# Altium schematic sheet Analog_Frontend01.SchDoc
size A4; DocumentNumber: 2; SheetNumber: 1; SheetTotal: 5
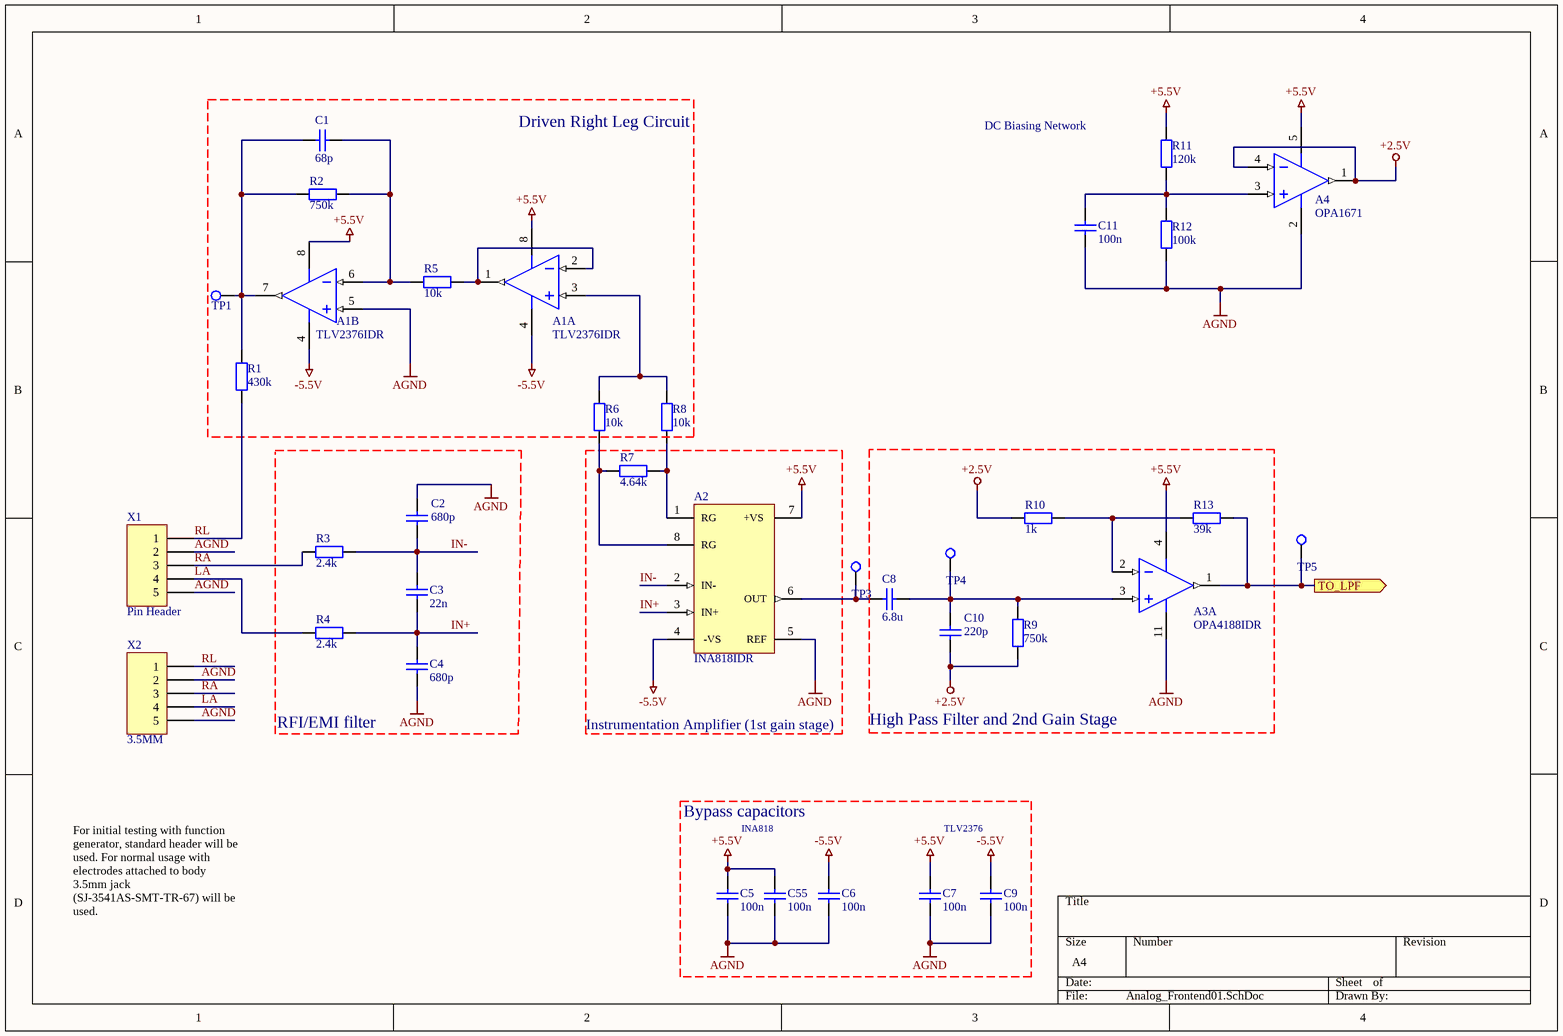
[diagram p0: Analog_Frontend01.SchDoc]

## Parts
A1  TLV2376IDR  [SOIC127P600X175-8N]  (parts A,B of 2)
A2  INA818IDR  [SOIC127P600X175-8N]
A3  OPA4188IDR  [SOIC127P600X175-14N]  (part A of 4)
A4  OPA1671  [SOT95P280X145-5N]
C1  68p  [CAPC1608X87N]
C2  680p  [CAPC2012X110N]
C3  22n  [CAPC3225X170N]
C4  680p  [CAPC2012X110N]
C5  100n  [CAPC1608X87N]
C6  100n  [CAPC1608X87N]
C7  100n  [CAPC1608X87N]
C8  6.8u  [CAPC2012X110N]
C9  100n  [CAPC1608X87N]
C10  220p  [CAPC1608X87N]
C11  100n  [CAPC1608X87N]
C55  100n  [CAPC1608X87N]
R1  430k  [RESC1608X55N]
R2  750k  [RESC1608X55N]
R3  2.4k  [RESC2012X70N]
R4  2.4k  [RESC2012X70N]
R5  10k  [RESC1608X55N]
R6  10k  [RESC1608X55N]
R7  4.64k  [RESC1608X55N]
R8  10k  [RESC1608X55N]
R9  750k  [RESC1608X55N]
R10  1k  [RESC1608X55N]
R11  120k  [RESC1608X55N]
R12  100k  [RESC1608X55N]
R13  39k  [RESC1608X55N]
TP1  TP  [TEST-POINT]  (value not drawn)  (no BOM)
TP3  TP  [TEST-POINT]  (value not drawn)  (no BOM)
TP4  TP  [TEST-POINT]  (value not drawn)  (no BOM)
TP5  TP  [TEST-POINT]  (value not drawn)  (no BOM)
X1  Pin Header  [SHDR5W64P0X250_1X5_1496X650X700P]
X2  3.5MM  [SJ23574ASMTTR]

## Blocks framed on the sheet
Driven Right Leg Circuit: A1 C1 R1 R2 R5 R6 R8 TP1
RFI/EMI filter: C2-C4 R3 R4
Instrumentation Amplifier (1st gain stage): A2 R7
High Pass Filter and 2nd Gain Stage: A3 C8 C10 R9 R10 R13 TP4
Bypass capacitors: C5-C7 C9 C55

## Ports
TO_LPF (out)

## Nets
+2.5V: A4.1(OUT) A4.4(IN-) C10.1 R9.1 R10.1
+5.5V: A1.8(+V) A2.7(+VS) A3.4(+V) A4.5(V+) C5.2 C7.2 C55.2 R11.1
-5.5V: A1.4(-V) A2.4(-VS) C6.2 C9.2
AGND: A1.5(+IN) A2.5(REF) A3.11(-V) A4.2(V-) C2.2 C4.1 C5.1 C6.1 C7.1 C9.1 C11.1 C55.1 R12.2 X1.2 X1.5 X2.2 X2.5
IN+: A2.3(IN+) C3.1 C4.2 R4.2
IN-: A2.2(IN-) C2.1 C3.2 R3.2
LA: R4.1 X1.4 X2.4
RA: R3.1 X1.3 X2.3
RL: R1.1 X1.1 X2.1
TO_LPF: A3.1(OUT_A) R13.2 TP5.0 ; port TO_LPF
NetA1_1: A1.1(OUT) A1.2(-IN) R5.2
NetA1_3: A1.3(+IN) R6.2 R8.2
NetA1_6: A1.6(-IN) C1.1 R2.2 R5.1
NetA1_7: A1.7(OUT) C1.2 R1.2 R2.1 TP1.0
NetA2_1: A2.1(RG) R7.2 R8.1
NetA2_6: A2.6(OUT) C8.2 TP3.0
NetA2_8: A2.8(RG) R6.1 R7.1
NetA3_2: A3.2(-IN_A) R10.2 R13.1
NetA3_3: A3.3(+IN_A) C8.1 C10.2 R9.2 TP4.0
NetA4_3: A4.3(IN+) C11.2 R11.2 R12.1

## Notes on the sheet
- DC Biasing Network
- INA818
- TLV2376
- For initial testing with function generator, standard header will be used. For normal usage with electrodes attached to body 3.5mm jack (SJ-3541AS-SMT-TR-67) will be used.

## Library data of the parts
A1 = AD706AR: Manufacturer 1: Texas Instruments; Manufacturer Part Number 1: TLV2376IDR
A2 = INAMP: Manufacturer 1: Texas Instruments; Manufacturer Part Number 1: INA818IDR; MOUSER Part Number: 595-INA818IDR
A3 = AD824ARZ-14-3V-RL: Manufacturer 1: Texas Instruments; Manufacturer Part Number 1: OPA4188AIDR
A4 = OPA336NJ/250: Manufacturer 1: Texas Instruments; Manufacturer Part Number 1: OPA1671IDBVR
C1 = Cap: Manufacturer 1: KEMET; Manufacturer Part Number 1: C0603C680M5HACTU
C2 C4 = Cap: Manufacturer 1: Panasonic; Manufacturer Part Number 1: ECH-U1H681GX5; MOUSER Part Number: 667-ECH-U1H681GX5
C3 = Cap: Manufacturer 1: Panasonic; Manufacturer Part Number 1: ECH-U1H223GX5; MOUSER Part Number: 667-ECH-U1H223GX5
C5-C7 C9 C11 = Cap: Manufacturer 1: Taiyo Yuden; Manufacturer Part Number 1: EMK107B7104KA-T
C8 = Cap: Manufacturer 1: TDK; Manufacturer Part Number 1: C2012X6S1C685M125AC
C10 = Cap: Manufacturer 1: Vishay/Vitramon; Manufacturer Part Number 1: VJ0603Y221KXJPW1BC
C55 = Cap: Capacitor; Manufacturer 1: Taiyo Yuden; Manufacturer Part Number 1: EMK107B7104KA-T
R1 = Res2: Manufacturer 1: Bourns; Manufacturer Part Number 1: CR0603-FX-4303ELF
R2 R9 = Res2: Manufacturer 1: Bourns; Manufacturer Part Number 1: CR0603-FX-7503ELF
R3 R4 = Res2: Manufacturer 1: Panasonic; Manufacturer Part Number 1: ERJ-6ENF2401V; MOUSER Part Number: 667-ERJ-6ENF2401V
R5 R6 R8 = Res2: Manufacturer 1: Yageo; Manufacturer Part Number 1: RC0603FR-0710KL; MOUSER Part Number: 603-RC0603FR-0710KL
R7 = Res2: Manufacturer 1: Bourns; Manufacturer Part Number 1: CR0603-FX-4641ELF
R10 = Res2: Manufacturer 1: Yageo; Manufacturer Part Number 1: RC0603FR-071KL
R11 = Res2: Manufacturer 1: Bourns; Manufacturer Part Number 1: CR0603-FX-1203ELF
R12 = Res2: Manufacturer 1: Panasonic; Manufacturer Part Number 1: ERJ-3EKF1003V
R13 = Res2: Manufacturer 1: Bourns; Manufacturer Part Number 1: CR0603-FX-3902ELF
TP1 TP3-TP5 = TEST_POINT: Generic test point
X1 = Header 5: Header, 5-Pin; Manufacturer 1: Molex; Manufacturer Part Number 1: 35312-0560
X2 = Header 5: Header, 5-Pin; Manufacturer 1: CUI Devices; Manufacturer Part Number 1: SJ-3541AS-SMT-TR-67